# Altium schematic sheet CON_CAN_RJ45.SchDoc: CAN Connector DB9 Male
size A4; Organization: Altium Limited.; Address1: Level 3, 12a Rodborough Rd; Address2: Frenchs Forest 2086; Address3: NSW; Address4: AUSTRALIA; Revision: 6; SheetNumber: 51; SheetTotal: 64
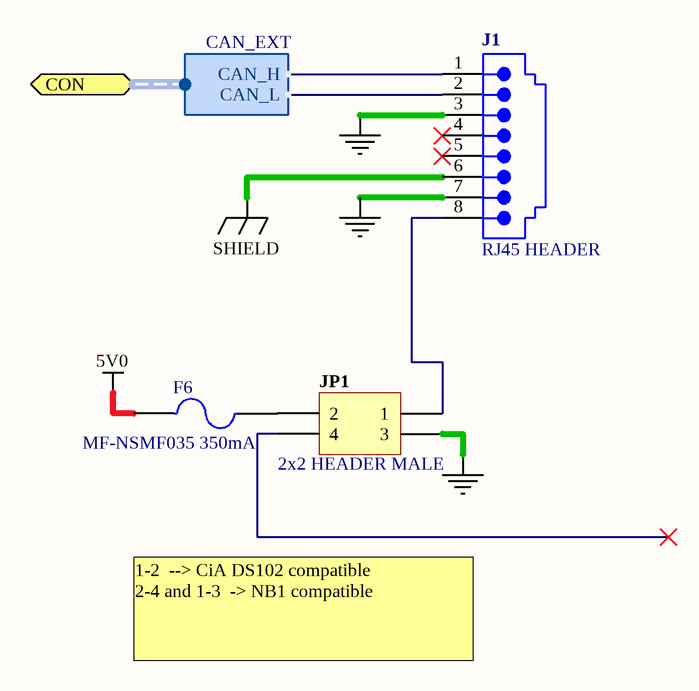
[diagram p0: CON_CAN_RJ45.SchDoc]

## Parts
F6  MF-NSMF035 350mA  [RESC3216]
J1  RJ45 HEADER  [15-43-6233]
JP1  2x2 HEADER MALE  [HDR2X2]

## Ports
CON (harness CAN_EXT)

## Harnesses
CAN_EXT: CAN_H, CAN_L

## Nets
5V0: F6.1
GND: J1.3 J1.7 JP1.3
SHIELD: J1.6
NetF6_2: F6.2 JP1.2
NetJ1_1: J1.1 ; port CON.CAN_H
NetJ1_2: J1.2 ; port CON.CAN_L
NetJ1_8: J1.8 JP1.1

Not connected (* = marked no-connect by the designer): J1 4* 5*; JP1 4*

## Notes on the sheet
- 1-2  --> CiA DS102 compatible
  2-4 and 1-3  -> NB1 compatible
- Sheet Title
- Project Title
- Size:
- Date:
- A4
- Assy:
- Time:
- Sheet
- Revision:
- of
- File:

## Library data of the parts
F6 = D-106-0001: Multifuse, SMD 1206, 350mA; Rated Voltage: 6 V; Amperage: 350 mA; Category: Fuse
J1 = D-300-0005: Connector, RJ45 Socket, Right-Angle, 8 Way (Ethernet), PCM8P8C; Category: Connector; Connector type: RJ45 HEADER; Status: Production
JP1 = D-300-0019: Header IDC, 2 x 2 Pin Vertical 2.54mm Pitch (Non-Boxed, Male); Max Current: 3 A; Category: Connector; Connector type: Header; Mounting Technology: Through-Hole; Pin Count: 4; Status: Production